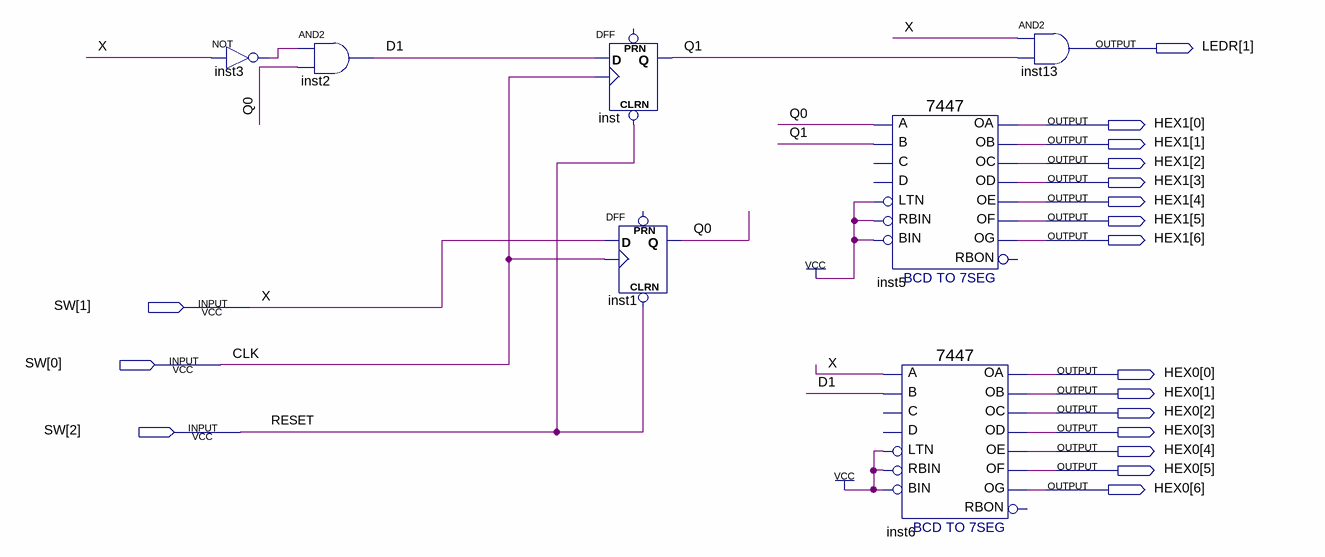
[diagram p0: schematic sheet]
// Quartus schematic FSM.bdf as structural Verilog: 7 symbols, 18 pins
module FSM (
  input  [2:0] SW,
  output [1:1] LEDR,
  output [6:0] HEX1,
  output [6:0] HEX0
);

  wire D1, inst3_out, Q0, Q1;

  not inst3 (inst3_out, SW[1]);
  and inst2 (D1, inst3_out, Q0);
  DFF inst (.CLRN(SW[2]), .CLK(SW[0]), .D(D1), .Q(Q1));  // open: PRN
  DFF inst1 (.CLRN(SW[2]), .CLK(SW[0]), .D(SW[1]), .Q(Q0));  // open: PRN
  \7447  inst5 (
    .LTN(1'b1), .B(Q1), .RBIN(1'b1), .BIN(1'b1), .A(Q0), .OB(HEX1[1]), .OC(HEX1[2]), .OE(HEX1[4]),
    .OD(HEX1[3]), .OF(HEX1[5]), .OG(HEX1[6]), .OA(HEX1[0]));  // open: C, D, RBON
  \7447  inst6 (
    .LTN(1'b1), .B(D1), .RBIN(1'b1), .BIN(1'b1), .A(SW[1]), .OB(HEX0[1]), .OC(HEX0[2]), .OE(HEX0[4]),
    .OD(HEX0[3]), .OF(HEX0[5]), .OG(HEX0[6]), .OA(HEX0[0]));  // open: C, D, RBON
  and inst13 (LEDR[1], SW[1], Q1);

  // Other names for the same wires on the sheet: CLK = SW[0]; RESET = SW[2]; X = SW[1]
endmodule
